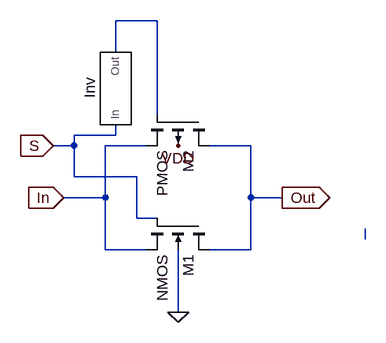
[diagram p0: schematic trans_gate.asc]
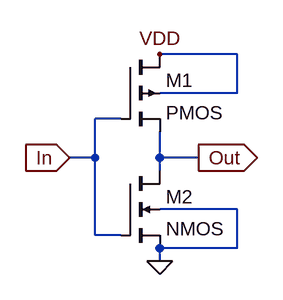
[diagram p1: sub-circuit inverter.asc]
trans_gate.asc, the LTspice schematic file:
Version 4
SHEET 1 880 680
WIRE 160 -96 96 -96
WIRE 96 -48 96 -96
WIRE 160 48 160 -96
WIRE 96 80 96 64
WIRE 96 80 32 80
WIRE 32 96 32 80
WIRE 32 96 0 96
WIRE 144 96 80 96
WIRE 304 96 240 96
WIRE 32 144 32 96
WIRE 128 144 32 144
WIRE 80 176 80 96
WIRE 80 176 16 176
WIRE 304 176 304 96
WIRE 352 176 304 176
WIRE 128 208 128 144
WIRE 160 208 128 208
WIRE 480 240 480 224
WIRE 80 256 80 176
WIRE 144 256 80 256
WIRE 304 256 304 176
WIRE 304 256 240 256
WIRE 192 352 192 256
FLAG 352 176 Out
IOPIN 352 176 Out
FLAG 192 352 0
FLAG 192 96 VDD
FLAG 16 176 In
IOPIN 16 176 In
FLAG 0 96 S
IOPIN 0 96 In
SYMBOL inverter 96 16 R270
SYMATTR InstName Inv
SYMBOL nmos4 240 208 R90
SYMATTR InstName M1
SYMBOL pmos4 240 48 R90
SYMATTR InstName M2

inverter.asc, the sub-circuit schematic file:
Version 4
SHEET 1 880 680
WIRE 320 80 224 80
WIRE 320 128 320 80
WIRE 320 128 224 128
WIRE 176 160 144 160
WIRE 144 208 144 160
WIRE 144 208 112 208
WIRE 224 208 224 176
WIRE 272 208 224 208
WIRE 224 224 224 208
WIRE 320 272 224 272
WIRE 144 304 144 208
WIRE 176 304 144 304
WIRE 320 320 320 272
WIRE 320 320 224 320
WIRE 224 336 224 320
FLAG 112 208 In
IOPIN 112 208 In
FLAG 272 208 Out
IOPIN 272 208 Out
FLAG 224 80 VDD
FLAG 224 336 0
SYMBOL pmos4 176 80 R0
SYMATTR InstName M1
SYMBOL nmos4 176 224 R0
SYMATTR InstName M2

The netlist it stands for:
* trans_gate.asc
XInv S N001 inverter
M1 Out S In 0 NMOS
M2 Out N001 In VDD PMOS

* block symbol definitions
.subckt inverter In Out
M1 VDD In Out VDD PMOS
M2 Out In 0 0 NMOS
.ends inverter

.model NMOS NMOS
.model PMOS PMOS
.lib standard.mos
.backanno
.end